# Altium schematic sheet 09-Transmitter.SchDoc
size A; SheetNumber: 9; SheetTotal: 10
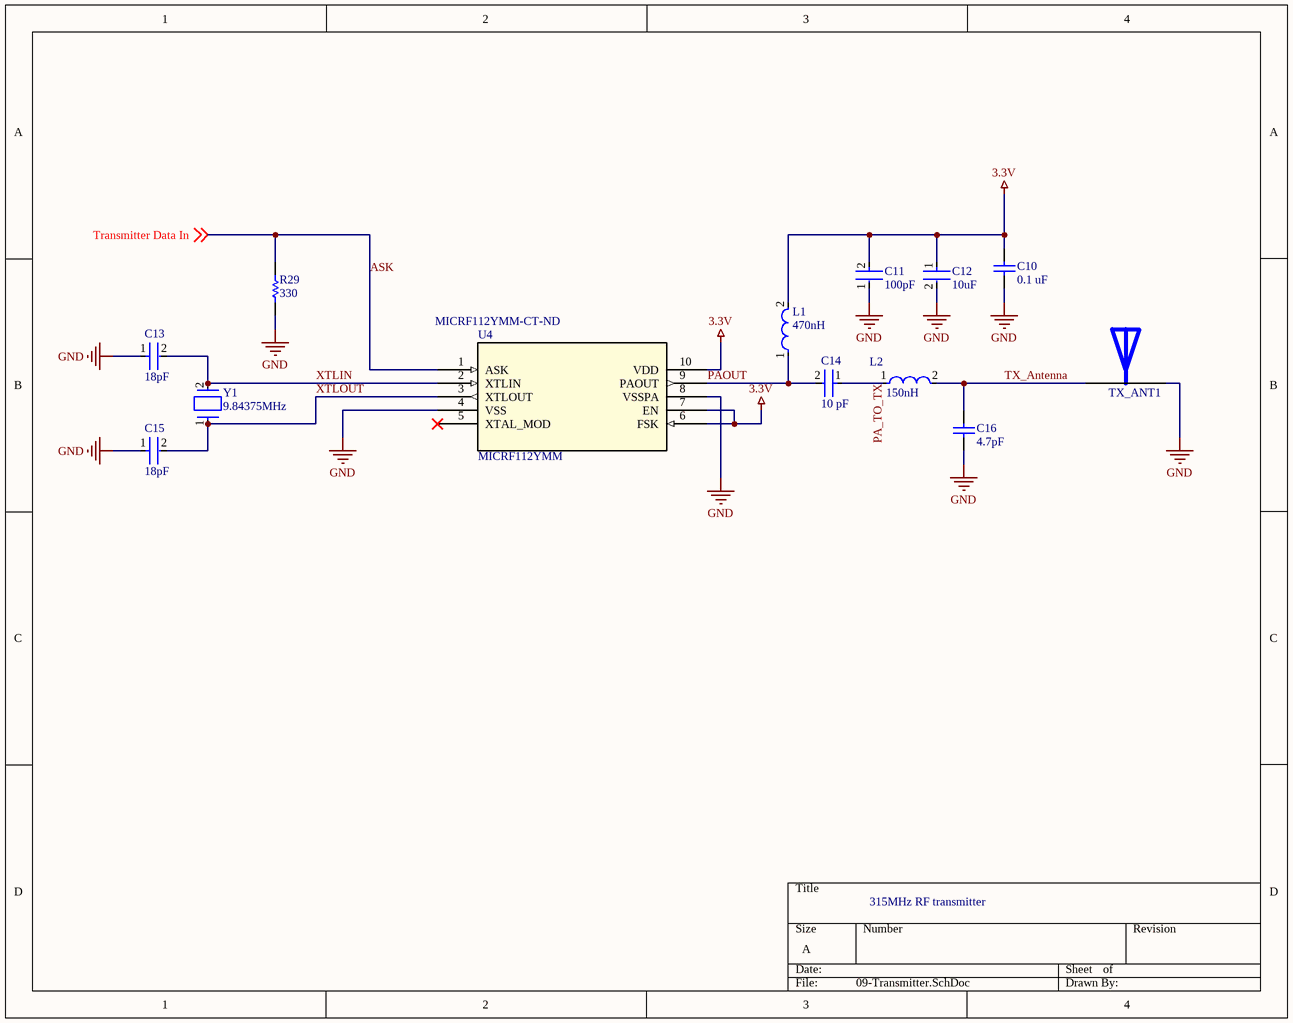
[diagram p0: 09-Transmitter.SchDoc]

## Parts
C10  0.1 uF  [CAPC2013X135X45ML10T25]
C11  100pF  [FP-C0805C-DN-MFG]
C12  10uF  [FP-C0805C-DG-MFG]
C13  18pF  [FP-C0805C-DN-MFG]
C14  10 pF  [FP-C0805C-DN-MFG]
C15  18pF  [FP-C0805C-DN-MFG]
C16  4.7pF  [CAPC2013X140X50NL20T25]
L1  470nH  [FP-LQW2UAS_00-MFG]
L2  150nH  [FP-LQW2BHN_03-MFG]
R29  330  [RESC2013X60X35ML10T20]
TX_ANT1  TX Antenna  [TX_Antenna]  (value not drawn)
U4  MICRF112YMM  Supplier Part Number 1: MICRF112YMM-CT-ND  [MSOP10_MC_MCH]
Y1  9.84375MHz  [FP-ABM7-MFG]

## Nets
3.3V: C10.1 C11.2 C12.1 L1.2 U4.6(FSK) U4.7(EN) U4.10(VDD)
GND: C10.2 C11.1 C12.2 C13.1 C15.1 C16.1 R29.1 TX_ANT1.2 U4.4(VSS) U4.8(VSSPA)
ASK: R29.2 U4.1(ASK) ; off-sheet Transmitter Data In  [also labelled Transmitter Data In]
PA_TO_TX: C14.1 L2.1
PAOUT: C14.2 L1.1 U4.9(PAOUT)
TX_Antenna: C16.2 L2.2 TX_ANT1.1
XTLIN: C13.2 U4.2(XTLIN) Y1.2
XTLOUT: C15.2 U4.3(XTLOUT) Y1.1

Not connected (* = marked no-connect by the designer): U4 5(XTAL_MOD)*

## Notes on the sheet
- 315MHz RF transmitter

## Library data of the parts
C10 = CMP-2100-03644-1: Chip Capacitor, 0.1 uF, +/- 10%, 50 V, -55 to 125 degC, 0805 (2012 Metric), RoHS, Tape and Reel; Manufacturer: Murata; Voltage: 50V; Capacitance: 100nF; Insulation Resistance: 10GR; Dielectric Material: Ceramic; Dielectric: X7R; Package Description: 2-Pin Surface Mount Device, Body 2 x 1.25 mm; Manufacturer URL: http://www.murata.com/; Case Code (Imperial): 0805; Datasheet URL: http://psearch.en.murata.com/capacitor/product/GRM21BR71H104KA01%23.pdf; Termination: SMD/SMT; Lead Free: LeadFree; Package Quantity: 1; Mount: SurfaceMount; REACH SVHC: Unknown; Thickness: 0.053inch; Height: 1.25mm; Case/Package: 0805; Voltage Rating: 50V; Width: 0.049inch; Case Code (Metric): 2012; Material: Ceramic; Min Operating Temperature: -55degC; RoHSCompliant: true; Datasheet Version: 42675.0; Voltage Rating (DC): 50V; Tolerance: 10%; Package Reference: 0805; Depth: 1.25mm; Length: 2mm; Max Operating Temperature: 125degC; Packaging: TapeandReel; Number of Pins: 2; Radiation Hardening: No
C11 = CMP-03020-013647-1: CAP CER 100PF 50V C0G/NP0 0805; Manufacturer Part Number: C0805C101J5GACTU; Manufacturer: KEMET; Temperature Characteristic: C0G; Tolerance: 0.05; Material: Ceramic; Temperature Coefficient: 30ppm/°C; Temperature Range High: +125°C; Voltage Rating: 50 V; Device Class L1: Passive Components; Category: Cap; Capacitance: 100 pF; Temperature Range Low: -55°C; Height: 0.88mm; Package: C0805C-DN; Device Class L2: Capacitors; Octopart: https://octopart.com/c0805c101j5gactu-kemet-100795; Ipc Land Pattern Name: CAPC200125X78; Value: 100 pF; RoHS: TRUE; Temperature: -55°C to +125°C; Lead Free: Yes; Automotive: No; ComponentLink2URL: https://content.kemet.com/datasheets/KEM_C1003_C0G_SMD.pdf; ComponentLink2Description: Datasheet; Digikey Description: CAP CER 100PF 50V C0G/NP0 0805; Device Class L3: Ceramic Capacitors
C12 = CMP-2007-03243-2: CAP CER 10UF 10V X5R 0805; Manufacturer Part Number: C0805C106K8PACTU; Manufacturer: Kemet; 3DS Part Number: 220-00001; Tolerance: 10%; Temperature Coefficient: 15%; Material: Ceramic; Device Class L2: Capacitors; Device Class L1: Passive Components; ComponentLink2URL: https://content.kemet.com/datasheets/KEM_C1006_X5R_SMD.pdf; Height: 1.4mm; Lead Free: Yes; Digikey Description: CAP CER 10UF 10V X5R 0805; Octopart: https://octopart.com/c0805c106k8pactu-kemet-98697; Capacitance: 10uF; Value: 10uF; Temperature Range Low: -55°C; Temperature: -55°C to +85°C; Automotive: No; Mouser Description: CAP CER 10UF 10V X5R 0805; Ipc Land Pattern Name: CAPC200125X125; Temperature Range High: +85°C; Voltage: 10V; RoHS: TRUE; Device Class L3: Ceramic Capacitors; ComponentLink2Description: Datasheet; Voltage Rating: 10V; Package: C0805C-DG; Temperature Characteristic: X5R; Category: Cap
C13 C15 = CMP-2007-00302-2: CAP CER 18PF 50V C0G/NP0 0805; Manufacturer: KEMET; Manufacturer Part Number: C0805C180J5GACTU; Temperature Characteristic: C0G; Tolerance: 0.05; Material: Ceramic; Temperature Coefficient: 30ppm/°C; Device Class L2: Capacitors; Capacitance: 18 pF; Temperature: -55°C to +125°C; Value: 18 pF; Package: C0805C-DN; Mouser Description: Cap Ceramic 18pF 50V C0G 5% SMD 0805 125C Paper T/R; Height: 0.88mm; ComponentLink2URL: https://content.kemet.com/datasheets/KEM_C1003_C0G_SMD.pdf; RoHS: TRUE; Octopart: https://octopart.com/c0805c180j5gactu-kemet-144810; ComponentLink2Description: Datasheet; Temperature Range High: +125°C; Digikey Description: CAP CER 18PF 50V C0G/NP0 0805; Device Class L1: Passive Components; Category: Cap; Automotive: No; Device Class L3: Ceramic Capacitors; Voltage Rating: 50 V; Temperature Range Low: -55°C; Ipc Land Pattern Name: CAPC200125X78; Lead Free: Yes; Supplier Part Number 1: 399-C0805C180J5GAC7800CT-ND
C14 = CMP-2007-00219-2: Capacitor; Ceramic; Cap 10 pF; Tol 5%; Vol-Rtg 50 VDC; SMT; 0805; COG (NPO); Tape&Reel; Manufacturer Part Number: C0805C100J5GACTU; Manufacturer: KEMET; Temperature Coefficient: 30ppm/°C; Voltage Rating: 50 V; Tolerance: 0.05; Temperature Characteristic: C0G; RoHS: TRUE; Mouser Description: KEMET - C0805C100J5GACTU - CAP, MLCC, C0G/NP0, 10PF, 50V, 0805; Temperature Range High: +125°C; Octopart: https://octopart.com/c0805c100j5gactu-kemet-104357; Automotive: No; Device Class L1: Passive Components; Temperature Range Low: -55°C; Value: 10 pF; Device Class L3: Ceramic Capacitors; Material: Ceramic; Device Class L2: Capacitors; Lead Free: Yes; Category: Cap; Ipc Land Pattern Name: CAPC200125X78; ComponentLink2Description: Datasheet; ComponentLink2URL: https://content.kemet.com/datasheets/KEM_C1003_C0G_SMD.pdf; Digikey Description: Capacitor; Ceramic; Cap 10 pF; Tol 5%; Vol-Rtg 50 VDC; SMT; 0805; COG (NPO); Tape&Reel; Temperature: -55°C to +125°C; Height: 0.88mm; Capacitance: 10 pF; Package: C0805C-DN
C16 = CMP-2007-04561-1: Manufacturer: AVX Interconnect / Elco; Part Number: 08051A4R7CAT2A
L1 = CMP-06042-015512-1: Wire Wound RF Inductor 470nH ±5% 470mA 1.19Ω 1008 (2520); Test Frequency: 25MHz; DC Resistance (DCR): 1.19R; Core Material: Air; Shielding: Unshielded; Self Resonant Frequency: 450MHz; Q Factor: 45; Case Code (Metric): 2520; Packaging: Tape and Reel; Inductance: 470nH; Tolerance: 5%; Width: 0.096inch; Radiation Hardening: No; Case Code (Imperial): 1008; Resistor Type: Wirewound; Depth: 2.65mm; Min Operating Temperature: -55°C; Inductance Tolerance: 5%; Max DC Current: 470mA; Mount: Surface Mount; Series: LQW2UA; Max Operating Temperature: 125°C; REACH SVHC: No SVHC; Termination: SMD/SMT; Current Rating: 470mA; Height - Seated (Max): 0.08inch; Package Quantity: 2000; Height: 1.83mm; Lead Free: Lead Free; Length: 0.103inch; Weight: 0.001376oz; Case/Package: 1008
L2 = CMP-06042-003065-1: Wire Wound RF Inductor 150nH ±5% 390mA 0.47Ω 0805 (2015); Q Factor: 30; Shielding: Unshielded; Core Material: Non-Magnetic; Test Frequency: 100MHz; Series Resistance: 470mR; Self Resonant Frequency: 350MHz; DC Current: 390mA; Tolerance: 5%; Max DC Current: 390mA; Radiation Hardening: No; Packaging: Tape and Reel; Case/Package: 0805; Package Quantity: 2000; Length: 2mm; Case Code (Imperial): 0805; Weight: 0.000317oz; Resistor Type: Wirewound; Height - Seated (Max): 0.07inch; Depth: 1.7mm; Min Operating Temperature: -40°C; Height: 1.7mm; Lead Free: Lead Free; Current Rating: 390mA; Case Code (Metric): 2012; Military Standard: Not; Inductance: 150nH; Mount: Surface Mount; Width: 0.059inch; DC Resistance (DCR): 470mR; Termination: SMD/SMT; Max Operating Temperature: 85°C
R29 = CMP-2100-03668-1: Chip Resistor, 100 KOhm, +/- 1%, 0.125 W, -55 to 155 degC, 0805 (2012 Metric), RoHS, Tape and Reel; Manufacturer: Yageo; Max Power Dissipation: 125mW; Voltage Rating: 150V; Temperature Coefficient: 100ppm/degreesC; Manufacturer URL: http://www.yageo.com/; Min Operating Temperature: -55degC; Lead Pitch: 0.4mm; Composition: ThickFilm; Case Code (Metric): 2012; Military Standard: Not; Package Description: 2-Pin Surface Mounted Device, Body 2 x 1.25 mm; REACH SVHC: Unknown; RoHSCompliant: true; Depth: 1.25mm; Number of Pins: 2; Lead Free: LeadFree; Resistance: 100KOhm; Datasheet URL: http://www.yageo.com/NewPortal/yageodocoutput?fileName=/pdf/R-Chip/PYu-RC_Group_51_RoHS_L_5.pdf; Max Operating Temperature: 155degC; Case/Package: 0805; Package Quantity: 1; Case Code (Imperial): 0805; Power Rating: 125mW; Width: 0.049inch; Package Reference: 0805; Height: 0.024inch; Termination: SMD/SMT; Tolerance: 1%; Datasheet Version: Rev. 5, 10/2016; Length: 2mm; Voltage Rating (DC): 150V; Number of Terminations: 2; Packaging: TapeandReel
U4 = MICRF112YMM: No Description Available; Mfr_Name: Microchip; Copyright: Copyright (C) 2022 Ultra Librarian. All rights reserved.; Manufacturer_Part_Number: MICRF112YMM; RefDes: RefDes; Type: DEV; Supplier 1: Digi-Key
Y1 = CMP-27762-013556-1: Crystal 9.84375MHz ±30ppm 10pF SMD-2 6mm x 3.5mm; Frequency Stability: 100ppm; ESR (Equivalent Series Resistance): 50R; Width: 0.138inch; Mount: Surface Mount; Height: 0.055inch; Case/Package: SMD/SMT; Frequency Tolerance: 30ppm; Max Operating Temperature: 85°C; Length: 0.236inch; Min Operating Temperature: -40°C; Packaging: Tape and Reel; Frequency: 9.84375MHz; Load Capacitance: 10pF